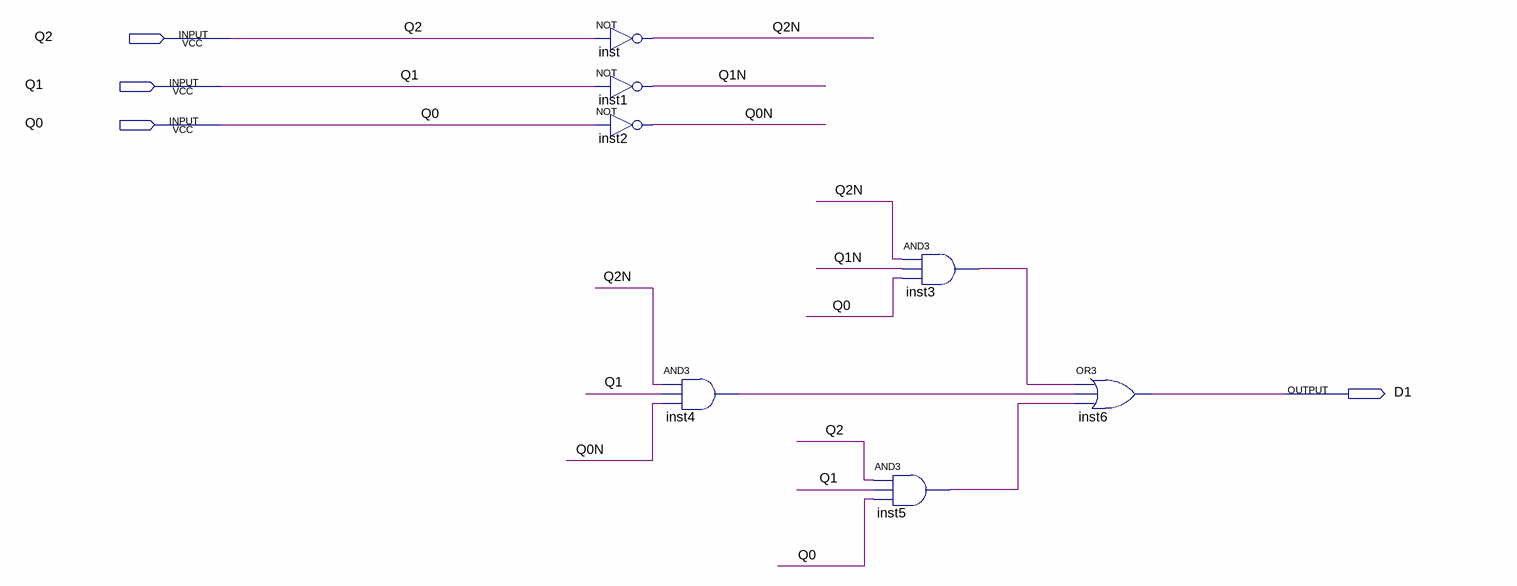
[diagram p0: schematic sheet]
// Quartus schematic D1.bdf as structural Verilog: 7 symbols, 4 pins
module D1 (
  input  Q2,
  input  Q1,
  input  Q0,
  output D1
);

  wire inst3_out, inst4_out, inst5_out, Q0N, Q1N, Q2N;

  not inst (Q2N, Q2);
  not inst1 (Q1N, Q1);
  not inst2 (Q0N, Q0);
  and inst4 (inst4_out, Q2N, Q1, Q0N);
  and inst3 (inst3_out, Q2N, Q1N, Q0);
  and inst5 (inst5_out, Q2, Q1, Q0);
  or inst6 (D1, inst3_out, inst4_out, inst5_out);
endmodule
